# Altium schematic sheet USB-UART.SchDoc
size A4; SheetNumber: 6; SheetTotal: 7
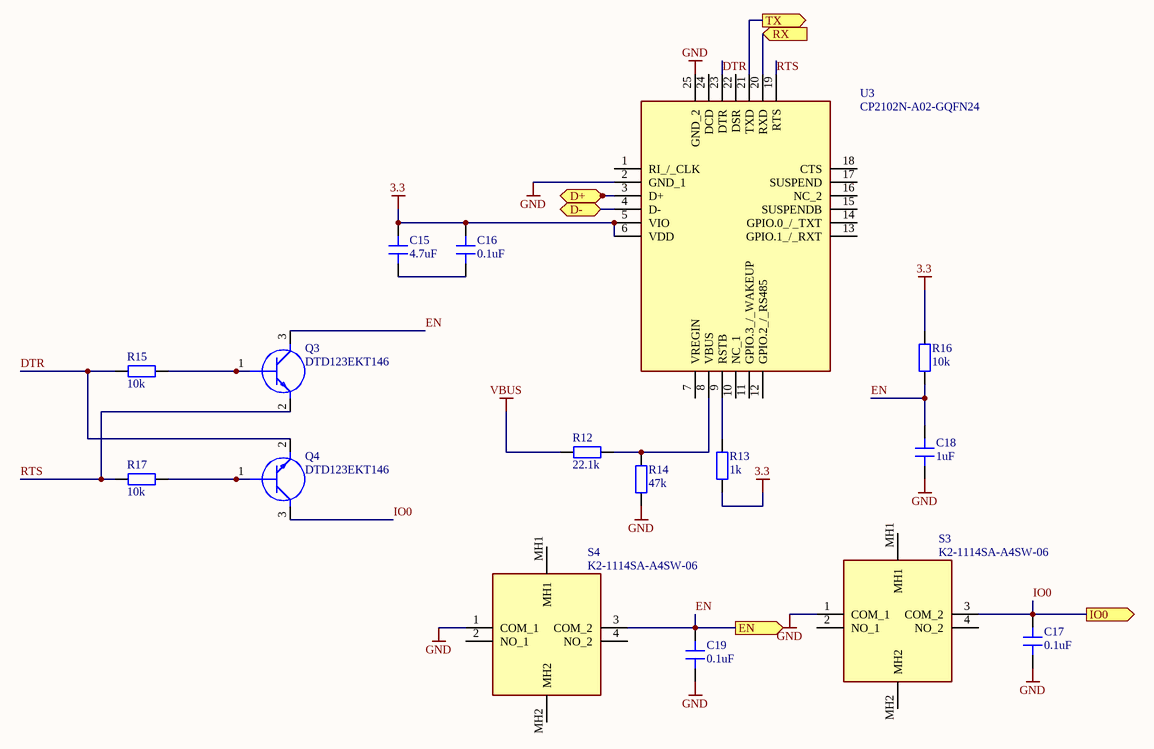
[diagram p0: USB-UART.SchDoc]

## Parts
C15  4.7uF  [0603_CAP]
C16  0.1uF  [0603_CAP]
C17  0.1uF  [0603_CAP]
C18  1uF  [0603_CAP]
C19  0.1uF  [0603_CAP]
Q3  DTD123EKT146  [FP-SS8050-G-IPC_A]
Q4  DTD123EKT146  [FP-SS8050-G-IPC_A]
R12  22.1k  [0402_RES]
R13  1k  [0402_RES]
R14  47k  [0402_RES]
R15  10k  [0402_RES]
R16  10k  [0402_RES]
R17  10k  [0402_RES]
S3  K2-1114SA-A4SW-06  [K21114SAA4SW06]
S4  K2-1114SA-A4SW-06  [K21114SAA4SW06]
U3  CP2102N-A02-GQFN24  [FP-CP2102N-A02-GQFN24-MFG]

## Ports
D+ (bidir, see Smart-Watch-Front[3B], USB-C[2C]), D- (bidir, see Smart-Watch-Front[3B], USB-C[2C]), EN (out, see Smart-Watch-Front[4B]), IO0 (out, see Smart-Watch-Front[4B]), RX (in, see Smart-Watch-Front[3B]), TX (out, see Smart-Watch-Front[4B])

## Nets
3.3: C15.1 C16.1 R13.2 R16.1 U3.5(VIO) U3.6(VDD)
GND: C17.2 C18.1 C19.2 R14.2 S3.1(COM_1) S4.1(COM_1) U3.2(GND_1) U3.25(GND_2)
VBUS: R12.2
D+: U3.3(D+) ; port D+
D-: U3.4(D-) ; port D-
DTR: Q4.2(E) R15.1 U3.23(DTR)
EN: C18.2 C19.1 Q3.3(C) R16.2 S4.3(COM_2) ; port EN
IO0: C17.1 Q4.3(C) S3.3(COM_2) ; port IO0
RTS: Q3.2(E) R17.1 U3.19(RTS)
RX: U3.20(RXD) ; port RX
TX: U3.21(TXD) ; port TX
NetC15_2: C15.2 C16.2
NetQ3_1: Q3.1(B) R15.2
NetQ4_1: Q4.1(B) R17.2
NetR12_1: R12.1 R14.1 U3.8(VBUS)
NetR13_1: R13.1 U3.9(RSTB)

Not connected (* = marked no-connect by the designer): S3 2(NO_1) 4(NO_2) MH1 MH2; S4 2(NO_1) 4(NO_2) MH1 MH2; U3 1(RI_/_CLK) 7(VREGIN) 10(NC_1) 11(GPIO.3_/_WAKEUP) 12(GPIO.2_/_RS485) 13(GPIO.1_/_RXT) 14(GPIO.0_/_TXT) 15(SUSPENDB) 16(NC_2) 17(SUSPEND) 18(CTS) 22(DSR) 24(DCD)

## Library data of the parts
C15-C19 = C
Q3 Q4 = DTD123EKT146: Transistor BJT NPN; Manufacturer_Name: ROHM Semiconductor; Datasheet Link: http://rohmfs.rohm.com/en/products/databook/datasheet/discrete/transistor/digital/dtd123ekt146-e.pdf; Height: 1.3mm; Manufacturer_Part_Number: DTD123EKT146; Mouser Part Number: 755-DTD123EKT146; Mouser Price/Stock: https://www.mouser.com/Search/Refine.aspx?Keyword=755-DTD123EKT146
R12-R17 = R
S3 S4 = K2-1114SA-A4SW-06: Switch; Manufacturer_Name: Korean Hroparts Elec; Datasheet Link: https://datasheet.lcsc.com/szlcsc/Korean-Hroparts-Elec-K2-1114SA-A4SW-06_C136662.pdf; Height: 1.65mm; Manufacturer_Part_Number: K2-1114SA-A4SW-06
U3 = CP2102N-A02-GQFN24: Integrated Circuit; Manufacturer_Name: Silicon Labs; Datasheet Link: https://componentsearchengine.com/Datasheets/1/CP2102N-A02-GQFN24.pdf; Height: 0.8mm; Manufacturer_Part_Number: CP2102N-A02-GQFN24; Mouser Part Number: 634-CP2102NA02GQFN24; Mouser Price/Stock: https://www.mouser.co.uk/ProductDetail/Silicon-Labs/CP2102N-A02-GQFN24?qs=u16ybLDytRYKabtL%2FE7DZA%3D%3D; Arrow Part Number: CP2102N-A02-GQFN24; Arrow Price/Stock: https://www.arrow.com/en/products/cp2102n-a02-gqfn24/silicon-labs?utm_currency=USD&region=europe